# Altium project B303CA.PrjPcb
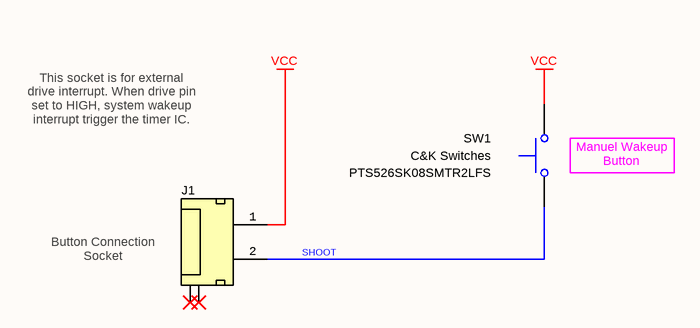
[diagram p0: Button.SchDoc]
Address1_: Buyuk Kayacik Mah. 4. OSB; Address2_: 103. Cad. No : 12; Address3_: Selcuklu / Konya; Address4_: Türkiye; Copyright_: Copyright 2022 STF Tarim (Commercial Secret); Customer_: STF Labs; Engineer_: Gunce Akkoyun; Git_Repo_Address_: www.github.com/akkoyun/B303CA; Module_ID_: B303CA; Organization_: STF Res-Dev; Product_Desc_: P101EA; Product_ID_: P101EA; Revision_: 00.00.01; Version_: R1
1 sheet, 2 parts. Net scope: global (net labels, ports and power ports of the same name join across sheets).
Board file: B303CA.PcbDoc

## Sheet Button.SchDoc: Button Module
size 292 x 193 mm; SheetNumber: 1; SheetTotal: 1

### Parts
J1  2P SMD Tunic Connector  [Connector_Tunic 2P]  (value not drawn)
SW1  Manufacturer Name: C&K Switches  [PTS526_Switch]  (hidden comment: PTS526SK08SMTR2LFS)

### Nets
VCC: J1.1(Pin1) SW1.2(COM)
SHOOT: J1.2(Pin2) SW1.1(NC)

Not connected (* = marked no-connect by the designer): J1 3(GND)* 4(GND)*

### Notes on the sheet
- This socket is for external drive interrupt. When drive pin set to HIGH, system wakeup interrupt trigger the timer IC.
- (near SW1) Manuel Wakeup Button
- (near J1) Button Connection
  Socket
- © 2021 All rights reserved.
  This document may not, in whole or in part, be copied, photocopied, reproduced, translated or converted to any electronic or machine readable from without prior written permission of Mehmet Günce Akkoyun.
  Engineer contact : akkoyun@me.com
- Property of
- Engineer :
- Date :
- Size :
- A4
- Time :
- Project :
- Page :
- /
- Customer :
- Product ID :
- Module ID :
- Version :
- File :
- Revision :

### Library data of the parts
J1 = Connector - Mini Tunic 2P (1.25): Mini Tunic Connector with 2P; Manufacturer Name: Molex; Manufacturer Part Number: 53261-0271; Height: 3.55mm; Mouser Part Number: 538-53261-0271; ROHS: Yes; System: Connector
SW1 = Switch - Push Button: Switch Tactile N.O. SPST Flush Round Button Gull Wing 0.05A 12VDC 200000Cycles 2.45N SMD T/R; Current Rating: 50 mA; Contact Form: SPST; Product Type: Tactile Switches; RoHS: Yes; Voltage Rating: 12 VDC; Case: SMD; Manufacturer Part Number: PTS526SK08SMTR2LFS